# Altium schematic sheet Sche_Main.SchDoc: Word Clock - Main board V1
size B; Address2: NSANGRB - PxF Team; DocumentNumber: 1; Revision: 1; SheetNumber: 1; SheetTotal: 1
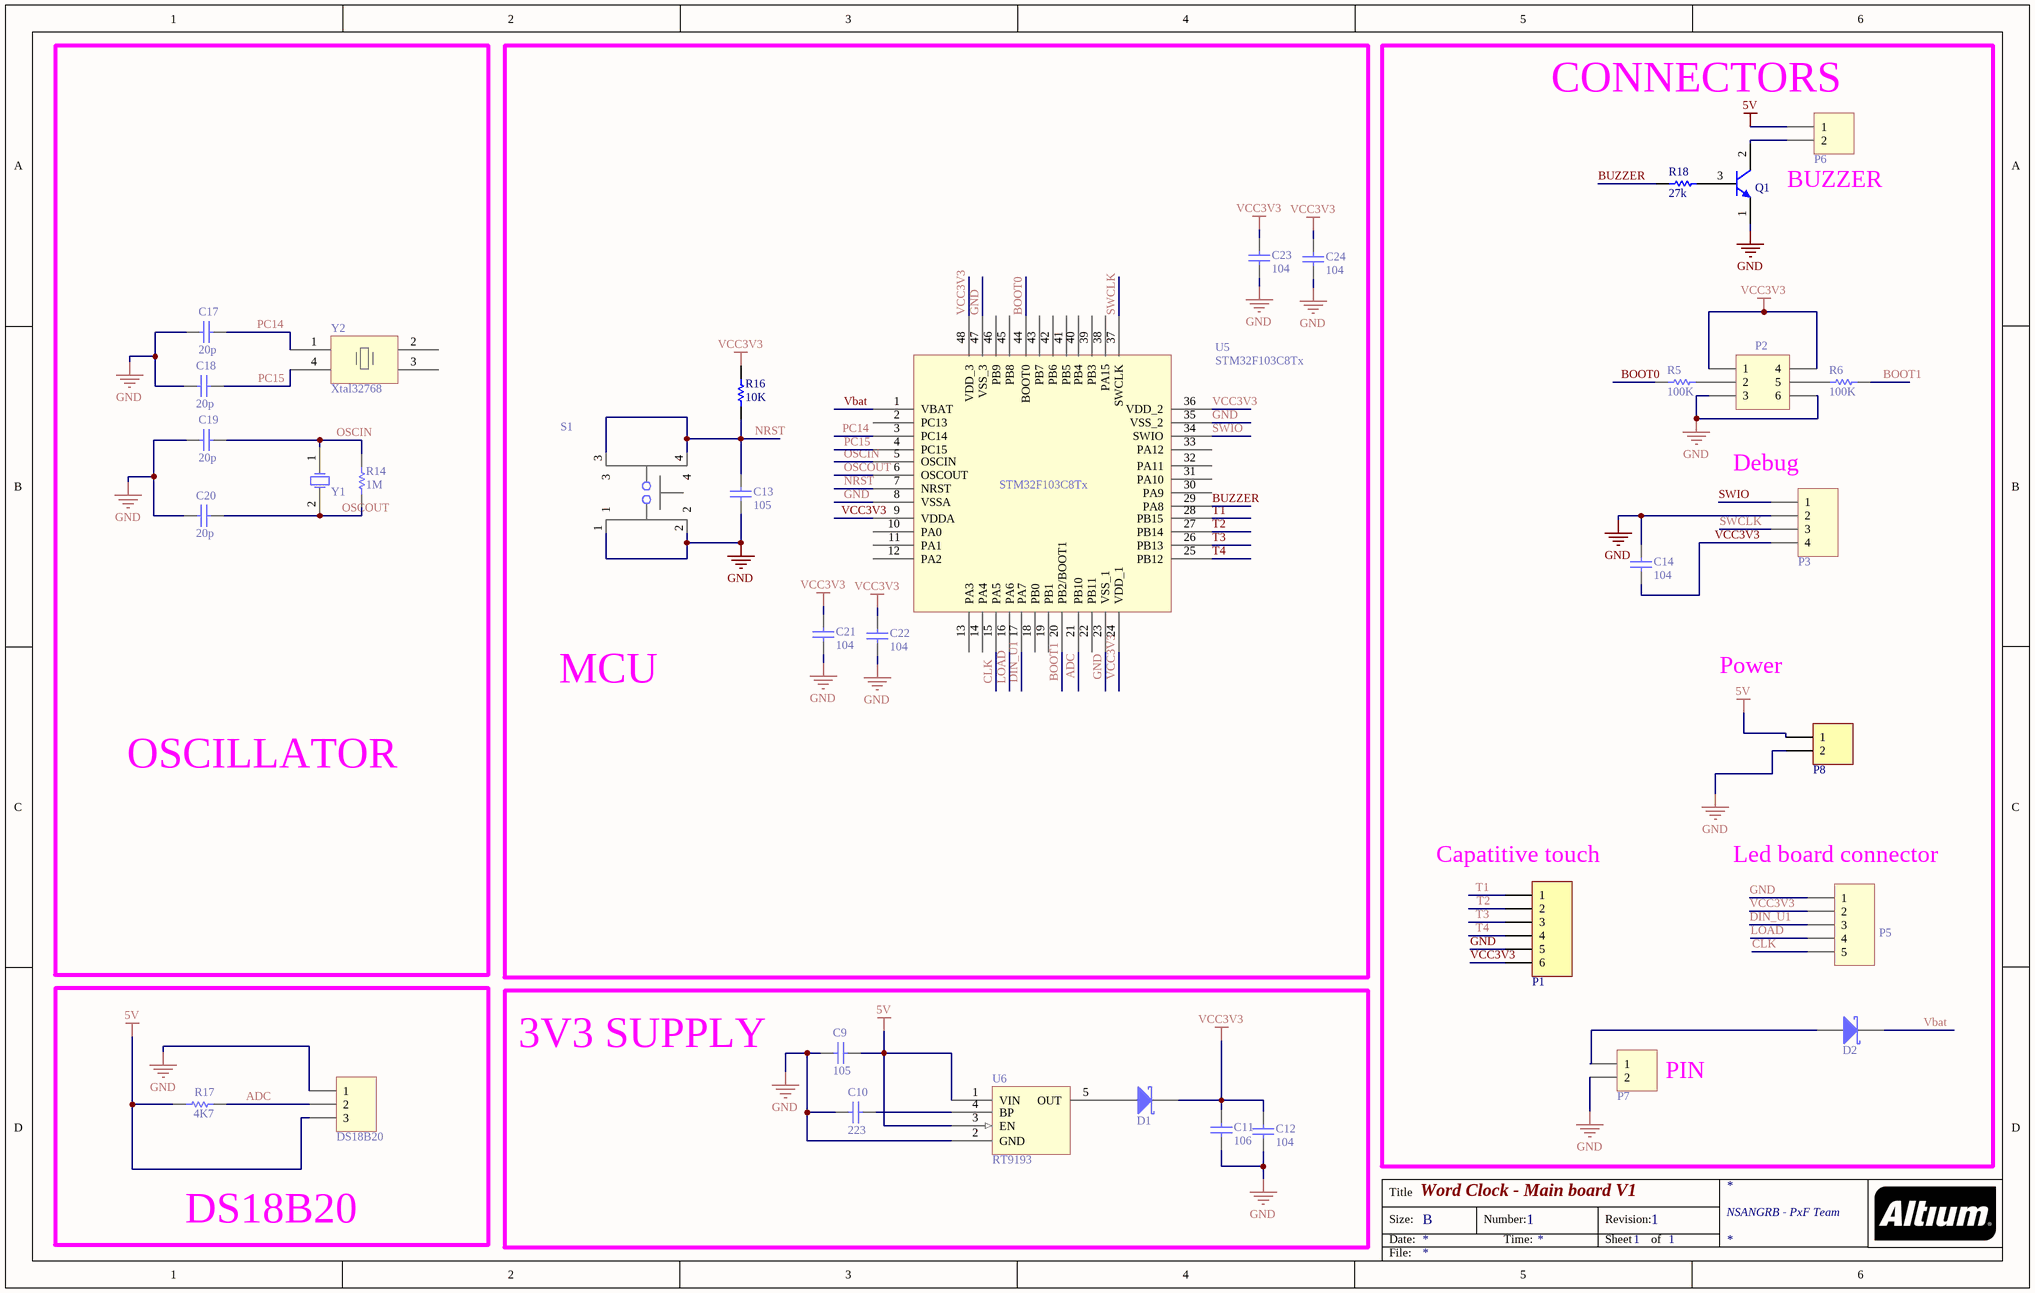
[diagram p0: Sche_Main.SchDoc]

## Parts
C9  value 105  [CAP-SM-0805]  (hidden comment: Cap Non-Pol SMD)
C10  value 223  [CAP-SM-0805]  (hidden comment: Cap Non-Pol SMD)
C11  value 106  [CAP-SM-0805]  (hidden comment: Cap Non-Pol SMD)
C12  value 104  [CAP-SM-0805]  (hidden comment: Cap Non-Pol SMD)
C13  value 105  [CAP-SM-0805]  (hidden comment: Cap Non-Pol SMD)
C14  value 104  [CAP-SM-0805]  (hidden comment: Cap Non-Pol SMD)
C17  value 20p  [CAP-SM-0805]  (hidden comment: Cap Non-Pol SMD)
C18  value 20p  [CAP-SM-0805]  (hidden comment: Cap Non-Pol SMD)
C19  value 20p  [CAP-SM-0805]  (hidden comment: Cap Non-Pol SMD)
C20  value 20p  [CAP-SM-0805]  (hidden comment: Cap Non-Pol SMD)
C21  value 104  [CAP-SM-0805]  (hidden comment: Cap Non-Pol SMD)
C22  value 104  [CAP-SM-0805]  (hidden comment: Cap Non-Pol SMD)
C23  value 104  [CAP-SM-0805]  (hidden comment: Cap Non-Pol SMD)
C24  value 104  [CAP-SM-0805]  (hidden comment: Cap Non-Pol SMD)
D1  D Schottky  [SS34]  (value not drawn)
D2  D Schottky  [SS34]  (value not drawn)
DS18B20  Header 3  [QTO-92]  (value not drawn)
P1  Header 6  [JP6]  (value not drawn)
P2  Header 3X2  [JP3x2]  (value not drawn)
P3  Header 4  [JP4]  (value not drawn)
P5  Header 5  [JP5]  (value not drawn)
P6  Domino 2  [JP2]  (value not drawn)
P7  Header 2  [JP2]  (value not drawn)
P8  Header 2  [JP2]  (value not drawn)
Q1  C1815  [SOT23B]  (value not drawn)
R5  value 100K  [RES-SM-0805]  (hidden comment: RESISTOR SMD)
R6  value 100K  [RES-SM-0805]  (hidden comment: RESISTOR SMD)
R14  value 1M  [RES-SM-0805]  (hidden comment: RESISTOR SMD)
R16  value 10K  [RES-SM-0805]  (hidden comment: RESISTOR SMD)
R17  value 4K7  [RES-SM-0805]  (hidden comment: RESISTOR SMD)
R18  value 27k  [RES-SM-0805]  (hidden comment: RESISTOR SMD)
S1  TL3342F160QG  [SW_TL3342F160QG]  (value not drawn)
U5  STM32F103C8Tx  [TSQFP50P900X900X160-48N]
U6  RT9193  [SOT95P279X129-5N]
Y1  XTAL  [XT2]  (value not drawn)
Y2  Xtal32768  [XTAL_ABS25-32.768KHZ-6-1-T]

## Blocks framed on the sheet
OSCILLATOR: C17-C20 R14 Y1 Y2
MCU: C13 C21-C24 R16 S1 U5
CONNECTORS: C14 D2 P1-P3 P5-P8 Q1 R5 R6 R18
DS18B20: DS18B20 R17
3V3 SUPPLY: C9-C12 D1 U6

## Nets
5V: C9.2 DS18B20.3 P6.1 P8.1 R17.1 U6.1(VIN) U6.3(EN)
GND: C9.1 C10.1 C11.1 C12.1 C13.1 C14.2 C17.1 C18.1 C19.1 C20.1 C21.1 C22.1 C23.1 C24.1 DS18B20.1 P1.5 P2.3 P2.6 P3.2 P5.1 P7.2 P8.2 Q1.1(E) S1.1 S1.2 U5.8(VSSA) U5.23(VSS_1) U5.35(VSS_2) U5.47(VSS_3) U6.2(GND)
VCC3V3: C11.2 C12.2 C14.1 C21.2 C22.2 C23.2 C24.2 D1.2(K) P1.6 P2.1 P2.4 P3.4 P5.2 R16.2 U5.9(VDDA) U5.24(VDD_1) U5.36(VDD_2) U5.48(VDD_3)
ADC: DS18B20.2 R17.2 U5.21(PB10)
BOOT0: R5.1 U5.44(BOOT0)
BOOT1: R6.2 U5.20(PB2/BOOT1)
BUZZER: R18.1 U5.29(PA8)
CLK: P5.5 U5.15(PA5)
DIN_U1: P5.3 U5.17(PA7)
LOAD: P5.4 U5.16(PA6)
NRST: C13.2 R16.1 S1.3 S1.4 U5.7(NRST)
OSCIN: C19.2 R14.2 U5.5(OSCIN) Y1.1(OSC1)
OSCOUT: C20.2 R14.1 U5.6(OSCOUT) Y1.2(OSC2)
PC14: C17.2 U5.3(PC14) Y2.1
PC15: C18.2 U5.4(PC15) Y2.4
SWCLK: P3.3 U5.37(SWCLK)
SWIO: P3.1 U5.34(SWIO)
T1: P1.1 U5.28(PB15)
T2: P1.2 U5.27(PB14)
T3: P1.3 U5.26(PB13)
T4: P1.4 U5.25(PB12)
Vbat: D2.2(K) U5.1(VBAT)
NetC10_2: C10.2 U6.4(BP)
NetD1_1: D1.1(A) U6.5(OUT)
NetD2_1: D2.1(A) P7.1
NetP2_2: P2.2 R5.2
NetP2_5: P2.5 R6.1
NetP6_2: P6.2 Q1.2(C)
NetQ1_3: Q1.3(B) R18.2

Not connected (* = marked no-connect by the designer): U5 2(PC13) 10(PA0) 11(PA1) 12(PA2) 13(PA3) 14(PA4) 18(PB0) 19(PB1) 22(PB11) 30(PA9) 31(PA10) 32(PA11) 33(PA12) 38(PA15) 39(PB3) 40(PB4) 41(PB5) 42(PB6) 43(PB7) 45(PB8) 46(PB9); Y2 2 3

## Notes on the sheet
- BUZZER
- (near P3) Debug
- Power
- (near P1) Capatitive touch
- (near P5) Led board connector
- (near P7) PIN
- Title
- Size:
- Date:
- B
- Number:
- Time:
- Revision:
- Sheet
- of
- File:

## Library data of the parts
C9-C14 C17-C24 = Cap Non-Pol SMD: Capacitor
D1 D2 = D Schottky: Schottky Diode; Published: 8-Jun-2000; LatestRevisionDate: 17-Jul-2002; LatestRevisionNote: Re-released for DXP Platform.; PackageReference: SMB; Publisher: Altium Limited; PackageDescription: DO-214-AA/SMB; 2 C-Bend Leads; Body 5.3 x 3.6 mm, inc. leads (LxW); Code_JEDEC: DO-214-AA
DS18B20 = Header 3: Header, 3-Pin; LatestRevisionDate: 17-Jul-2002; LatestRevisionNote: Re-released for DXP Platform.; Publisher: Altium Limited
P1 = Header 6: Header, 6-Pin; LatestRevisionDate: 17-Jul-2002; LatestRevisionNote: Re-released for DXP Platform.; Publisher: Altium Limited
P2 = Header 3X2: Header, 3-Pin, Dual row; LatestRevisionDate: 17-Jul-2002; LatestRevisionNote: Re-released for DXP Platform.; Publisher: Altium Limited
P3 = Header 4: Header, 4-Pin; LatestRevisionDate: 17-Jul-2002; LatestRevisionNote: Re-released for DXP Platform.; Publisher: Altium Limited
P5 = Header 5: Header, 5-Pin; LatestRevisionDate: 17-Jul-2002; LatestRevisionNote: Re-released for DXP Platform.; Publisher: Altium Limited
P6 = Domino 2: Domino, 2-Pin; LatestRevisionDate: 17-Jul-2002; LatestRevisionNote: Re-released for DXP Platform.; Publisher: Altium Limited
P7 P8 = Header 2: Header, 2-Pin; LatestRevisionDate: 17-Jul-2002; LatestRevisionNote: Re-released for DXP Platform.; Publisher: Altium Limited
Q1 = C1815: NPN Bipolar Transistor
R5 R6 R14 R16-R18 = RESISTOR SMD: Resistor
S1 = TL3342F160QG: TL3342 Series SPST 1.6 N Round Button Gull Wing Surface Mount Tactile Switch; MF: E-Switch; SnapEDA_Link: https://www.snapeda.com/parts/TL3342F160QG/E-Switch/view-part/?ref=snap; Package: None; MP: TL3342F160QG; Availability: Good; Price: 0.41 USD; Value: *
U5 = STM32F103C8Tx: MCU 32-bit STM32F ARM Cortex M3 RISC 64KB Flash 2.5V/3.3V 48-Pin LQFP Tray; Manufacturer: STMicroelectronics; Manufacturer Part Number: STM32F103C8T6; Data Bus Width: 32bit; Maximum Frequency: 72MHz; RAM Size: 20 kB; USB Channels: 1 x Device; Number of PWM Units: 1; ADC Channels: 10; Number of SPI Channels: 2; Typical Operating Supply Voltage: 2 → 3.6 V; Pulse Width Modulation: 1(16 bit) (Motor Control); Timers: 3 x 16 bit; Timer Resolution: 16bit; ADC Resolution: 12bit; Number of Timers: 3; ADCs: 2(10 x 12 bit); Supplier 1: Digi-Key; Stock 1: 2771; Pricing 1: 1=6.06, 10=5.438, 100=4.4558, 500=3.7931, 1000=3.199 (USD); Family Name: STM32F; Package Type: LQFP; Mounting Type: Surface Mount; Pin Count: 48; Device Core: ARM Cortex M3; Program Memory Size: 64 kB; Length: 7.2mm; Dimensions: 7.2 x 7.2 x 1.45mm; Number of ADC Units: 2; Number of USART Channels: 3; PWM Resolution: 16bit; Instruction Set Architecture: RISC; Height: 1.45mm; Maximum Operating Temperature: +85 °C; Number of I2C Channels: 2; Width: 7.2mm; Program Memory Type: Flash; Minimum Operating Temperature: -40 °C; Number of CAN Channels: 1; ComponentLink1URL: https://datasheet.ciiva.com/16210/cd00161566-16210248.pdf; ComponentLink1Description: https://datasheet.ciiva.com/16210/cd00161566-16210248.pdf; ComponentLink2URL: https://datasheet.ciiva.com/14100/pustm-arm-microcont-stm32f103-en-14100508.pdf; ComponentLink2Description: https://datasheet.ciiva.com/14100/pustm-arm-microcont-stm32f103-en-14100508.pdf; ComponentLink3URL: https://datasheet.ciiva.com/15122/getdatasheetpartid-69880-15122076.pdf; ComponentLink3Description: https://datasheet.ciiva.com/15122/getdatasheetpartid-69880-15122076.pdf; ComponentLink4URL: https://datasheet.ciiva.com/8054/1730126-8054942.pdf; ComponentLink4Description: https://datasheet.ciiva.com/8054/1730126-8054942.pdf; ComponentLink5URL: https://datasheet.ciiva.com/48687/001075658-da-01-en-mcu-64kb-mem-stm32f103c8t6-lqfp-48-stm-48687589.pdf; ComponentLink5Description: https://datasheet.ciiva.com/48687/001075658-da-01-en-mcu-64kb-mem-stm32f103c8t6-lqfp-48-stm-48687589.pdf; ComponentLink6URL: https://datasheet.ciiva.com/26816/stm32f103c8t6-26816902.pdf; ComponentLink6Description: https://datasheet.ciiva.com/26816/stm32f103c8t6-26816902.pdf; Supplier Part Number 1: 497-6063-ND
U6 = RT9193: RICHTEK         RT9193-15GB            IC, LDO, FIXED, 1.5V, 0.3A, SOT-23-5; Input Voltage Min: 2.5V; Input Voltage Max: 5.5V; Output Current: 300mA; LDO Regulator Case Style: SOT-23; No. of Pins: 5Pins; SVHC: No SVHC (17-Dec-2015); Supplier 1: Newark; Manufacturer: Richtek; Stock 1: 2999; Output Voltage Nom.: 1.5V; Operating Temperature Min: -40°C; Operating Temperature Max: 85°C; Packaging: Each; ComponentLink1URL: http://www.farnell.com/datasheets/1720535.pdf; ComponentLink1Description: http://www.farnell.com/datasheets/1720535.pdf; ComponentLink2URL: http://www.richtek.com/assets/product_file/RT9193/DS9193-16.pdf; ComponentLink2Description: http://www.richtek.com/assets/product_file/RT9193/DS9193-16.pdf; Supplier Part Number 1: 42AC0083; Manufacturer Part Number: RT9193-15GB
Y1 = XTAL: Crystal Oscillator; Published: 8-Jun-2000; LatestRevisionDate: 17-Jul-2002; LatestRevisionNote: Re-released for DXP Platform.; PackageReference: R38; Publisher: Altium Limited; PackageDescription: Crystal, Thru-Hole; 2 Leads; Body 3.1 x 8.2 mm (Dia.xH)